# Altium schematic sheet relay and contactor.SchDoc
size A3; SheetNumber: 4; SheetTotal: 7
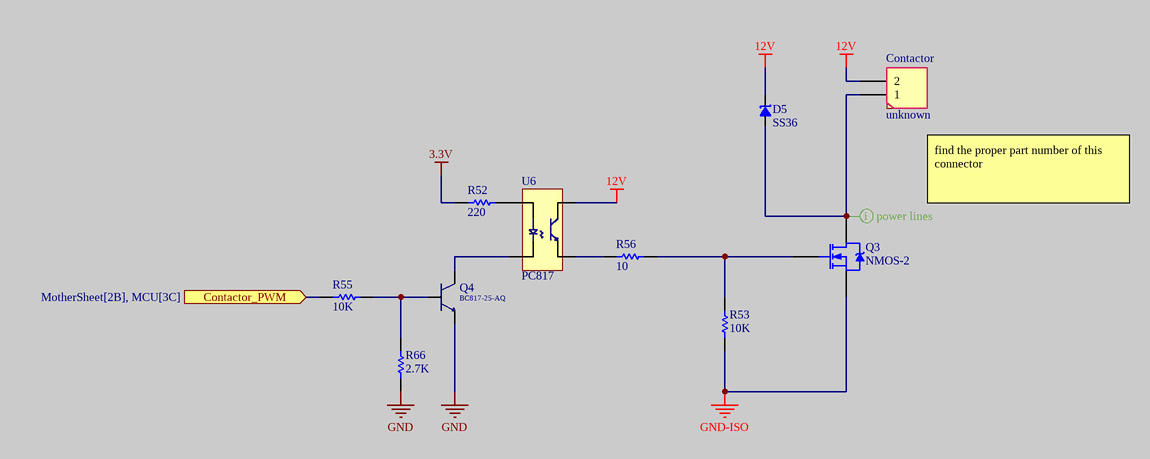
[diagram p0: relay and contactor.SchDoc]

## Parts
Contactor  unknown  [LED-RIGHT]
D5  SS36  [SMA]
Q3  NMOS-2  [dpak]
Q4  Transistor: BC817-25-AQ  [NPN]  (hidden comment: NPN transistor)
R52  220  [RESC0603]
R53  10K  [RESC0603]
R55  10K  [RESC0603]
R56  10  [RESC0603]
R66  2.7K  [RESC0603]
U6  PC817  [PC817]

## Ports
Contactor_PWM (in, see MotherSheet[2B], MCU[3C])

## Nets
3.3V: R52.2
12V: Contactor.2 D5.2(K) U6.4
GND: Q4.2(E) R66.2
GND-ISO: Q3.3(S) R53.1
Contactor_PWM: R55.2 ; port Contactor_PWM
NetContactor_1: Contactor.1 D5.1(A) Q3.2(D)
NetQ3_1: Q3.1(G) R53.2 R56.1
NetQ4_1: Q4.1(B) R55.1 R66.1
NetQ4_3: Q4.3(C) U6.2
NetR52_1: R52.1 U6.1
NetR56_2: R56.2 U6.3

## Layout directives
rule Width Constraint [Pref Width = 1mm    Min Width = 1mm    Max Width = 1mm]; rule Routing Via Style [Pref Size = 2mm    Pref Hole Size = 1mm]; rule Routing Via Style [Pref Size = 2mm    Pref Hole Size = 1mm]: NetContactor_1

## Notes on the sheet
- find the proper part number of this connector

## Library data of the parts
Contactor = Header1*2: Header, 2-Pin
D5 = SS36: Fast Schottky Diode; Published: 8-Jun-2000; LatestRevisionDate: 17-Jul-2002; LatestRevisionNote: Re-released for DXP Platform.; PackageReference: SMB; Publisher: Altium Limited; Code_JEDEC: DO-214-AA
Q3 = NMOS-2: N-Channel Power MOSFET; Note: Pin 2 is electrically connected to pin 4.; Published: 8-Jun-2000; LatestRevisionDate: 17-Jul-2002; LatestRevisionNote: Re-released for DXP Platform.; DatasheetVersion: PD-9.814; PackageVersion: Feb-1997; PackageReference: TO-220AB; Publisher: Altium Limited; PackageDescription: TO, Thru-Hole, Vertical, Heatsink Mounted; 3 In-Line Leads; Pitch 2.54 mm; ComponentLink1Description: Manufacturer Link; ComponentLink1URL: http://www.irf.com/
Q4 = BC817: 45 V, 0.5 A
R52 R53 R55 R56 R66 = Resistor: 0603,0.1W; Published: 8-Jun-2000; LatestRevisionDate: 17-Jul-2002; LatestRevisionNote: Re-released for DXP Platform.; PackageReference: AXIAL-0.5; Publisher: Altium Limited
  R52: Value: 220
  R53 R55: Value: 10K
  R56: Value: 10
  R66: Value: 2.7K
U6 = PC817: PC817 optocoupler